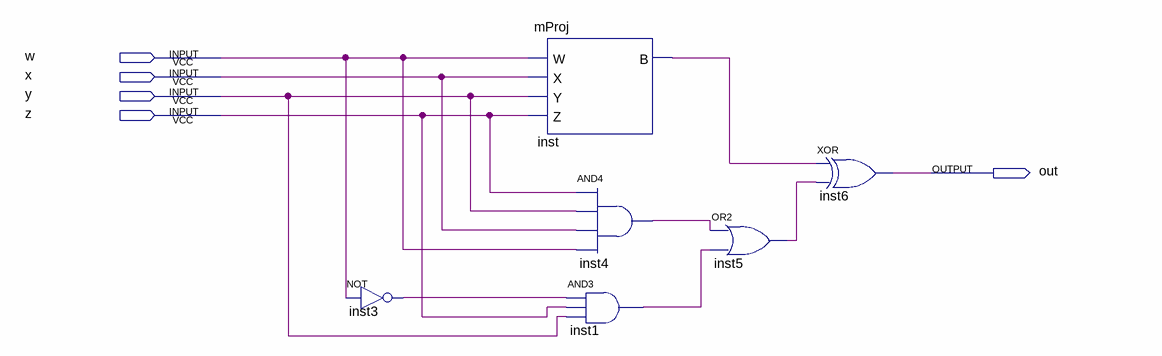
[diagram p0: schematic sheet]
// Quartus schematic mini.bdf as structural Verilog: 6 symbols, 5 pins
module mini (
  input  w,
  input  x,
  input  y,
  input  z,
  output out
);

  wire inst1_out, inst3_out, inst4_out, inst5_out, inst_b;

  not inst3 (inst3_out, w);
  mProj inst (.W(w), .X(x), .Y(y), .Z(z), .B(inst_b));
  and inst1 (inst1_out, inst3_out, z, y);
  and inst4 (inst4_out, z, y, x, w);
  or inst5 (inst5_out, inst4_out, inst1_out);
  xor inst6 (out, inst_b, inst5_out);
endmodule
